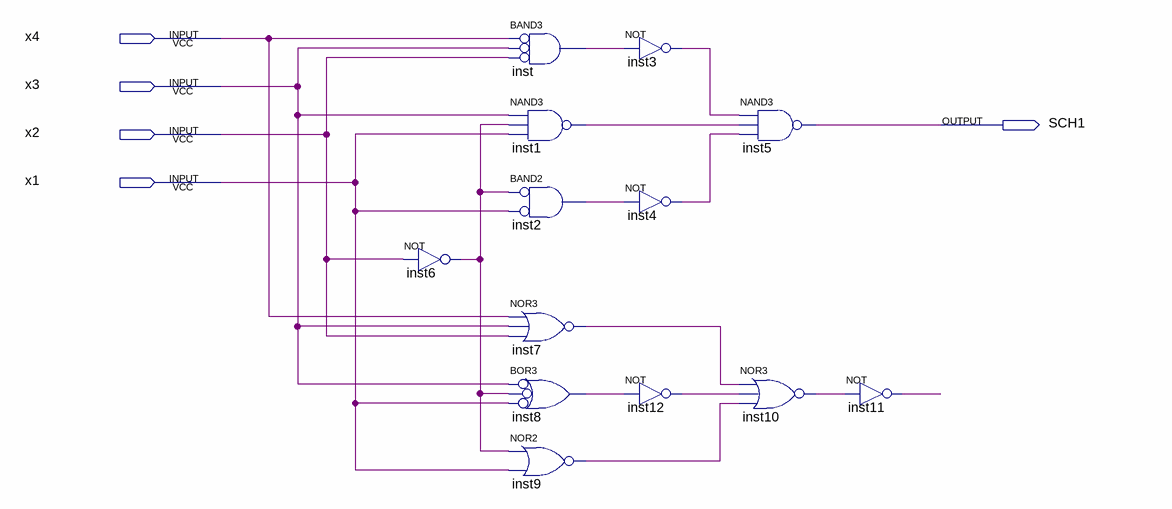
[diagram p0: schematic sheet]
// Quartus schematic lab1.bdf as structural Verilog: 13 symbols, 5 pins
module lab1 (
  input  x4,
  input  x3,
  input  x2,
  input  x1,
  output SCH1
);

  wire inst1_out, inst2_out, inst3_out, inst4_out, inst6_out, inst7_out, inst8_out, inst9_out, inst10_out,
       inst11_out, inst12_out, inst_out;

  not inst6 (inst6_out, x2);
  and inst (inst_out, ~x4, ~x3, ~x2);  // BAND3
  nand inst1 (inst1_out, x3, inst6_out, x1);
  and inst2 (inst2_out, ~inst6_out, ~x1);  // BAND2
  nor inst7 (inst7_out, x4, x3, x2);
  or inst8 (inst8_out, ~x3, ~inst6_out, ~x1);  // BOR3
  nor inst9 (inst9_out, inst6_out, x1);
  not inst3 (inst3_out, inst_out);
  not inst4 (inst4_out, inst2_out);
  not inst12 (inst12_out, inst8_out);
  nand inst5 (SCH1, inst3_out, inst1_out, inst4_out);
  nor inst10 (inst10_out, inst7_out, inst12_out, inst9_out);
  not inst11 (inst11_out, inst10_out);
endmodule
